# EAGLE design control_100 (EAGLE 6.1)
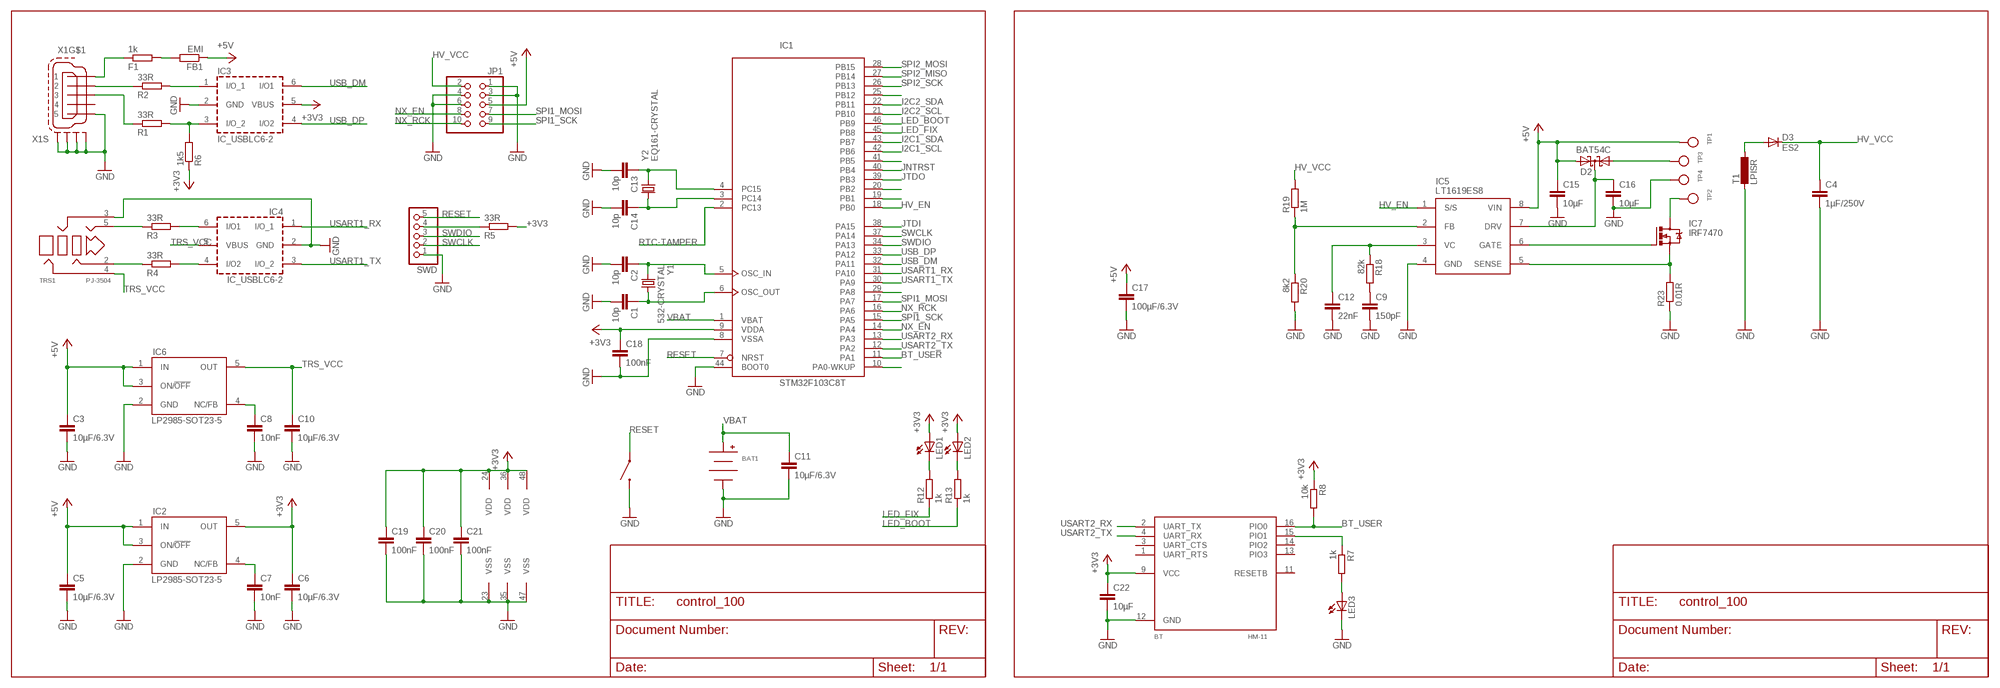
[diagram p0: schematic, sheet 1]

## Parts
BAT1  CR1220-HOLDER  [HARWIN-CR1220]
BT  HM-11  [HM-11]
C1  10p  C-EUC0603  [C0603]
C2  10p  C-EUC0603  [C0603]
C3  10µF/6.3V  C-EUC0603  [C0603]
C4  1µF/250V  C-EUC2220K  [C2220K]
C5  10µF/6.3V  C-EUC0603  [C0603]
C6  10µF/6.3V  C-EUC0603  [C0603]
C7  10nF  C-EUC0603  [C0603]
C8  10nF  C-EUC0603  [C0603]
C9  150pF  C-EUC0603  [C0603]
C10  10µF/6.3V  C-EUC0603  [C0603]
C11  10µF/6.3V  C-EUC0603  [C0603]
C12  22nF  C-EUC0603  [C0603]
C13  10p  C-EUC0603  [C0603]
C14  10p  C-EUC0603  [C0603]
C15  10µF  C-EUC0603  [C0603]
C16  10µF  C-EUC0603  [C0603]
C17  100µF/6.3V  C-EUC1210  [C1210]
C18  100nF  C-EUC0603  [C0603]
C19  100nF  C-EUC0603  [C0603]
C20  100nF  C-EUC0603  [C0603]
C21  100nF  C-EUC0603  [C0603]
C22  10µF  C-EUC0603  [C0603]
D2  BAT54C  [SOT23]
D3  ES2  [DO-214AA]
F1  1k  R-EU_R0603  [R0603]
FB1  EMI  R-EU_R0603  [R0603]
IC1  STM32F103C8T  [LQFP48]
IC2  LP2985-SOT23-5  [SOT23-5]
IC3  IC_USBLC6-2  [SOT-23-6L]
IC4  IC_USBLC6-2  [SOT-23-6L]
IC5  LT1619ES8  [SO8]
IC6  LP2985-SOT23-5  [SOT23-5]
IC7  IRF7470  [SO8]
ISP  TACT-SWITCH-40-40  [40-40]
JP1  PINHD-2X5_2.54-SMD  [2X05SMD]
LED1  LEDCHIP-LED0603  [CHIP-LED0603]
LED2  LEDCHIP-LED0603  [CHIP-LED0603]
LED3  LEDCHIP-LED0603  [CHIP-LED0603]
R1  33R  R-EU_R0603  [R0603]
R2  33R  R-EU_R0603  [R0603]
R3  33R  R-EU_R0603  [R0603]
R4  33R  R-EU_R0603  [R0603]
R5  33R  R-EU_R0603  [R0603]
R6  1k5  R-EU_R0603  [R0603]
R7  1k  R-EU_R0603  [R0603]
R8  10k  R-EU_R0603  [R0603]
R12  1k  R-EU_R0603  [R0603]
R13  1k  R-EU_R0603  [R0603]
R18  82k  R-EU_R0603  [R0603]
R19  1M  R-EU_M1206  [M1206]
R20  8k2  R-EU_R0603  [R0603]
R23  0.01R  R-EU_R1206  [R1206]
SWD  HEADER-1X5ROUND  [1X05_ROUND]
T1  LPISR  [PISR]
TP1  TESTPOINTROUND2MM  [TESTPOINT_ROUND_2MM]
TP2  TESTPOINTROUND2MM  [TESTPOINT_ROUND_2MM]
TP3  TESTPOINTROUND2MM  [TESTPOINT_ROUND_2MM]
TP4  TESTPOINTROUND2MM  [TESTPOINT_ROUND_2MM]
TRS1  PJ-3504  [YD-PJ-3504]
X1  MINI-USB-SCHIELD-32005-201  [32005-201]
Y1  532-CRYSTAL  [2PIN50X32]
Y2  EQ161-CRYSTAL  [EQ161]

## Nets
+3V3: BT.9(VCC) C6.1 C18.1 C19.1 C20.1 C21.1 C22.1 IC1.9(VDDA) IC1.24(VDD) IC1.36(VDD) IC1.48(VDD) IC2.5(OUT) IC3.5(VBUS) LED1.A LED2.A R5.2 R6.1 R8.1
+5V: C3.1 C5.1 C15.1 C17.1 D2.2(A2) FB1.1 IC2.1(IN) IC2.3(ON/!OFF) IC5.8(VIN) IC6.1(IN) IC6.3(ON/!OFF) JP1.5 TP1.P$1
ASDAWJIODJA: R5.1 SWD.4
BT_USER: BT.16(PIO0) IC1.11(PA1) R8.2
GND: BAT1.NEG BT.12(GND) C1.2 C2.2 C3.2 C4.2 C5.2 C6.2 C7.2 C8.2 C9.2 C10.2 C11.2 C12.2 C13.2 C14.2 C15.2 C16.2 C17.2 C18.2 C19.2 C20.2 C21.2 C22.2 IC1.8(VSSA) IC1.23(VSS) IC1.35(VSS) IC1.44(BOOT0) IC1.47(VSS) IC2.2(GND) IC3.2(GND) IC4.2(GND) IC5.4(GND) IC6.2(GND) ISP.1 ISP.2 JP1.1 JP1.3 JP1.4 JP1.6 LED3.C R20.2 R23.1 SWD.1 T1.P$2 TP4.P$1 TRS1.3 X1.5 X1.M1(S:S1) X1.M2(S:S2) X1.M3(S:S3) X1.M4(S:S4)
HV_EN: IC1.18(PB0) IC5.1(S/S)
HV_VCC: C4.1 D3.C JP1.2 R19.2
I2C1_SCL: IC1.42(PB6)
I2C1_SDA: IC1.43(PB7)
I2C2_SCL: IC1.21(PB10)
I2C2_SDA: IC1.22(PB11)
JNTRST: IC1.40(PB4)
JTDI: IC1.38(PA15)
JTDO: IC1.39(PB3)
LED_BOOT: IC1.46(PB9) R13.1
LED_FIX: IC1.45(PB8) R12.1
N$1: C1.1 IC1.6(OSC_OUT) Y1.P$1
N$2: C2.1 IC1.5(OSC_IN) Y1.P$2
N$3: F1.1 X1.1
N$4: C8.1 IC6.4(NC/FB)
N$5: IC3.3(I/O_2) R1.2 R6.2
N$7: IC4.6(I/O1) R3.2
N$8: D2.1(A1) TP3.P$1
N$9: IC5.6(GATE) IC7.4(G)
N$10: LED2.C R13.2
N$11: LED1.C R12.2
N$12: R4.1 TRS1.2
N$13: IC7.5(D) IC7.6(D) IC7.7(D) IC7.8(D) TP2.P$1
N$14: C12.1 IC5.3(VC) R18.1
N$15: C9.1 R18.2
N$16: D3.A T1.P$1
N$17: IC5.2(FB) R19.1 R20.1
N$18: IC5.5(SENSE) IC7.1(S) IC7.2(S) IC7.3(S) R23.2
N$19: C16.1 D2.3(CC) IC5.7(DRV)
N$20: C7.1 IC2.4(NC/FB)
N$22: F1.2 FB1.2
N$23: IC3.1(I/O_1) R2.2
N$24: R2.1 X1.2
N$25: IC4.4(I/O2) R4.2
N$26: BT.15(PIO1) R7.1
N$27: LED3.A R7.2
N$28: R3.1 TRS1.5
N$29: C13.1 IC1.4(PC15) Y2.P$1
N$30: C14.1 IC1.3(PC14) Y2.P$2
N$32: IC1.19(PB1)
N$34: IC1.20(PB2)
N$36: R1.1 X1.3
N$38: IC1.29(PA8)
N$42: IC1.10(PA0-WKUP)
N$48: IC1.41(PB5)
N$55: IC1.25(PB12)
NX_EN: IC1.14(PA4) JP1.8
NX_RCK: IC1.16(PA6) JP1.10
RESET: IC1.7(NRST) ISP.3 ISP.4 SWD.5
RTC-TAMPER: IC1.2(PC13)
SPI1_MOSI: IC1.17(PA7) JP1.7
SPI1_SCK: IC1.15(PA5) JP1.9
SPI2_MISO: IC1.27(PB14)
SPI2_MOSI: IC1.28(PB15)
SPI2_SCK: IC1.26(PB13)
SWCLK: IC1.37(PA14) SWD.2
SWDIO: IC1.34(PA13) SWD.3
TRS_VCC: C10.1 IC4.5(VBUS) IC6.5(OUT) TRS1.4
USART1_RX: IC1.31(PA10) IC4.1(I/O_1)
USART1_TX: IC1.30(PA9) IC4.3(I/O_2)
USART2_RX: BT.2(UART_TX) IC1.13(PA3)
USART2_TX: BT.4(UART_RX) IC1.12(PA2)
USB_DM: IC1.32(PA11) IC3.6(I/O1)
USB_DP: IC1.33(PA12) IC3.4(I/O2)
VBAT: BAT1.POS C11.1 IC1.1(VBAT)
Unconnected: BT.1(UART_RTS) BT.3(UART_CTS) BT.11(RESETB) BT.13(PIO3) BT.14(PIO2) X1.4

## Library data of the parts
BAT1 = battery-holder:CR1220-HOLDER
BT = bt:HM-11
C1-C22 = rcl:C-EU: CAPACITOR, European symbol
D2 = diode:BAT54C: Schottky Diodes Source: Fairchild .. BAT54.pdf
D3 = diode:ES2
F1 FB1 R1-R8 R12 R13 R18-R20 R23 = rcl:R-EU_: RESISTOR, European symbol
IC1 = micro-stm_v3:STM32F103C*T: ARM 32-bit Cortex™-M3 CPU 72 MHz maximum frequency 16 to 128 Kbytes of Flash memory 6 to 20 kbytes of SRAM 37 GPIOs 2.0 to 3.6 V application supply
IC2 IC6 = vreg:LP2985
IC3 IC4 = dp_devices:IC_USBLC6-2
IC5 = lt:LT1619
IC7 = ir:IRF7470
ISP = tactile-switch:TACT-SWITCH-40-40
JP1 = con-pinhead:PINHD-2X5: PIN HEADER
LED1-LED3 = led:LED: LED OSRAM: - CHIPLED LG R971, LG N971, LY N971, LG Q971, LY Q971, LO R971, LY R971 LH N974, LH R974 LS Q976, LO Q976, LY Q976 LO Q996 - Hyper CHIPLED LW Q18S LB Q993, LB Q99A, LB R99A - SideLED LS A670, LO A670, LY A670, LG A670, LP A670 LB A673, LV A673, LT A673, LW A673 LH A674 LY A675 LS A676, LA A676, LO A676, LY A676, LW A676 LS A679, LY A679, LG A679 - Hyper Micro SIDELED® LS Y876, LA Y876, LO Y876, LY Y876 LT Y87S - SmartLED LW L88C, LW L88S LB L89C, LB L89S, LG L890 LS L89K, LO L89K, LY L89K LS L896, LA L896, LO L896, LY L896 - TOPLED LS T670, LO T670, LY T670, LG T670, LP T670 LSG T670, LSP T670, LSY T670, LOP T670, LYG T670 LG T671, LOG T671, LSG T671 LB T673, LV T673, LT T673, LW T673 LH T674 LS T676, LA T676, LO T676, LY T676, LB T676, LH T676, LSB T676, LW T676 LB T67C, LV T67C, LT T67C, LS T67K, LO T67K, LY T67K, LW E67C LS E67B, LA E67B, LO E67B, LY E67B, LB E67C, LV E67C, LT E67C LW T67C LS T679, LY T679, LG T679 LS T770, LO T770, LY T770, LG T770, LP T770 LB T773, LV T773, LT T773, LW T773 LH T774 LS E675, LA E675, LY E675, LS T675 LS T776, LA T776, LO T776, LY T776, LB T776 LHGB T686 LT T68C, LB T68C - Hyper Mini TOPLED® LB M676 - Mini TOPLED Santana® LG M470 LS M47K, LO M47K, LY M47K Source: http://www.osram.convergy.de LUXEON: - LUMILED® LXK2-PW12-R00, LXK2-PW12-S00, LXK2-PW14-U00, LXK2-PW14-V00 LXK2-PM12-R00, LXK2-PM12-S00, LXK2-PM14-U00 LXK2-PE12-Q00, LXK2-PE12-R00, LXK2-PE12-S00, LXK2-PE14-T00, LXK2-PE14-U00 LXK2-PB12-K00, LXK2-PB12-L00, LXK2-PB12-M00, LXK2-PB14-N00, LXK2-PB14-P00, LXK2-PB14-Q00 LXK2-PR12-L00, LXK2-PR12-M00, LXK2-PR14-Q00, LXK2-PR14-R00 LXK2-PD12-Q00, LXK2-PD12-R00, LXK2-PD12-S00 LXK2-PH12-R00, LXK2-PH12-S00 LXK2-PL12-P00, LXK2-PL12-Q00, LXK2-PL12-R00 Source: www.luxeon.com KINGBRIGHT: KA-3528ASYC Source: www.kingbright.com
SWD = microbuilder:HEADER-1X5: PIN HEADER
T1 = fastron:L
TP1-TP4 = microbuilder:TESTPOINT: Test Point Various test points for characterisation and PCB testing TESTPOINT_SMT - Compact Surface Mount Test Point [Digikey: 5016KTR-ND]
TRS1 = con-trs:PJ-3504
X1 = con-cypressindustries:MINI-USB-SCHIELD-: MINI USB-B Conector Source: www.cypressindustries.com; OC_FARNELL: unknown; OC_NEWARK: unknown
Y1 = euroquartz:532-CRYSTAL
Y2 = euroquartz:EQ161-CRYSTAL: ￼Miniature SMD 3.2 x 1.5 x 0.75mm

## Board
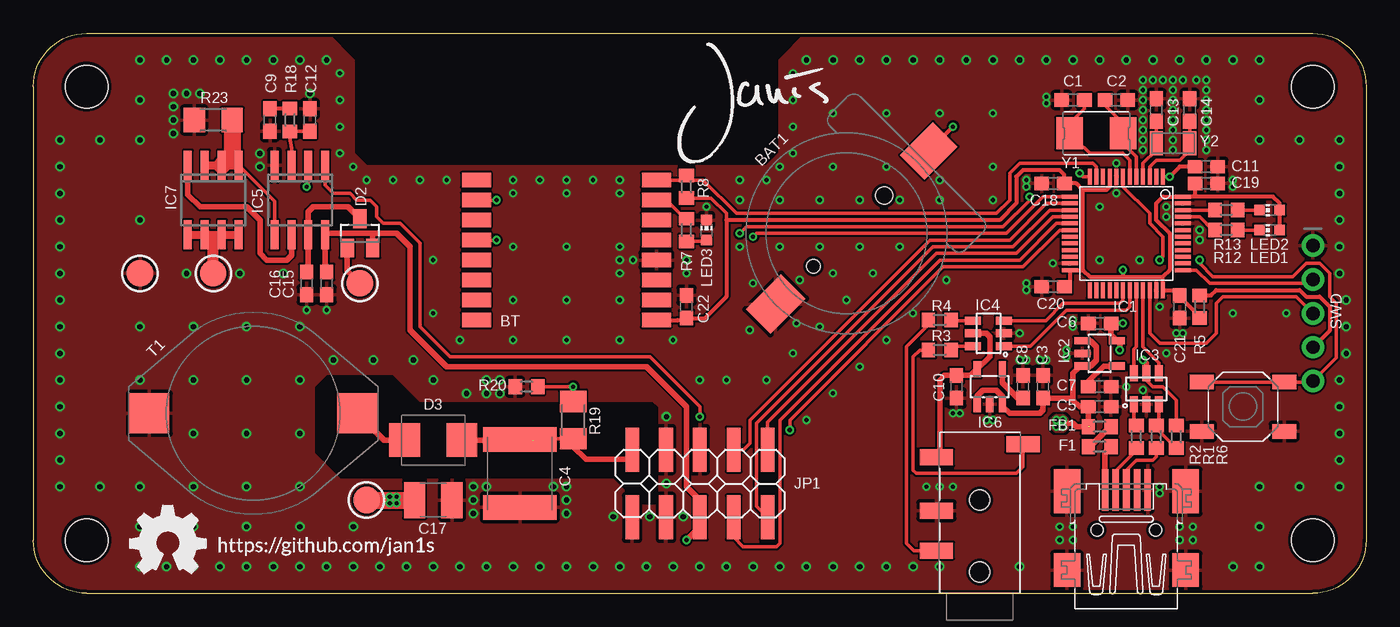
[diagram p1: board, top side]
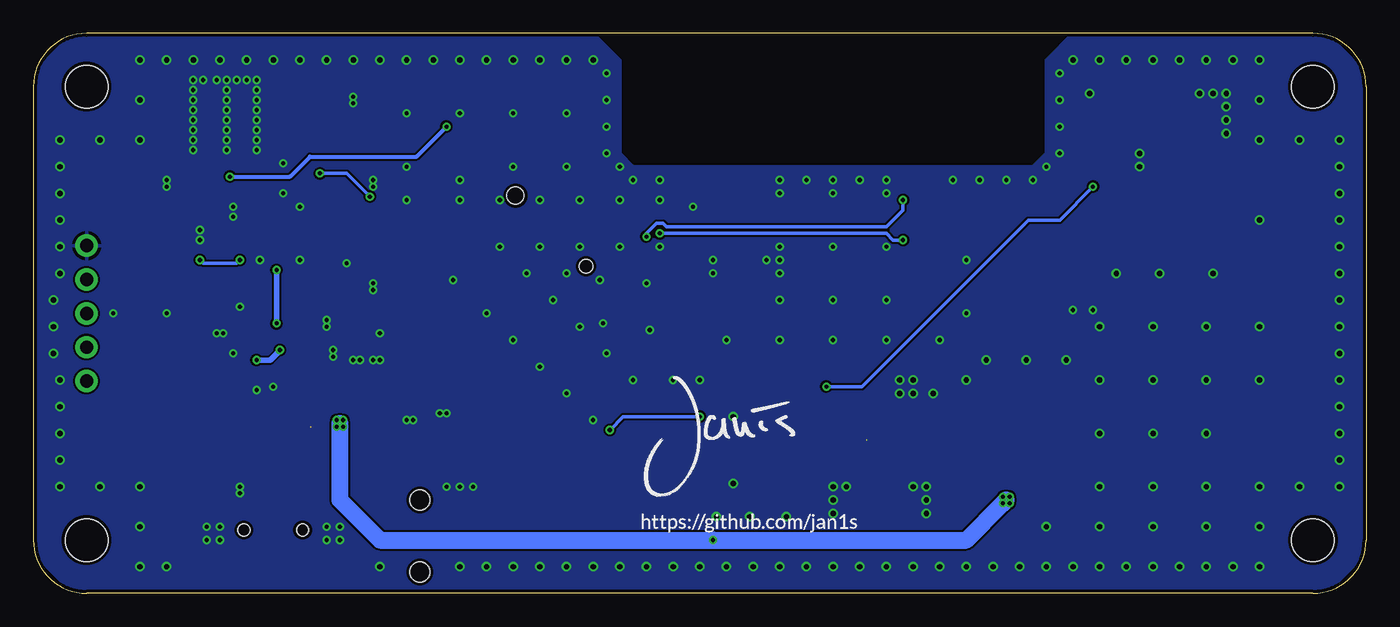
[diagram p2: board, bottom side, seen from below]

Size 100 x 42 mm. Coordinates in mm from the lower left corner, seen from the top.
Outline: 4,0 96,0 arc90 100,4 100,38 arc90 96,42 4,42 arc90 0,38 0,4 arc90 4,0
Copper layers (1*16): Top 0.035mm / dielectric 1.5mm / Bottom 0.035mm
Design rules: minimum track width 6mil, minimum drill 12mil, track to track 6mil, track to pad 6mil, pad to pad 6mil, via to via 6mil, smd to smd 0mil, copper to edge 10mil, drill to drill 10mil, minimum pad ring 10mil, minimum via ring 6mil, stop-mask expansion 2mil, vias tented up to drill 100mil, thermal gap 10mil
Holes 3.2 mm at 4,38 96,38 96,4 4,4

### Footprints (pad centres in the part's own frame; a part is rotated, then mirrored left to right if it is on the bottom)
HARWIN-CR1220 = smd 2.6 x 3.75: NEG 0,7.5 | smd 2.6 x 3.5: POS 0,-8.75 | hole 1: 0,3.5 | hole 1.3: 0,-4
HM-11 = smd 2.184 x 1.067: 1 -6.75,0; 2 -6.75,-1.5; 3 -6.75,-3; 4 -6.75,-4.5; 5 -6.75,-6; 6 -6.75,-7.5; 7 -6.75,-9; 8 -6.75,-10.5; 9 6.75,-10.5; 10 6.75,-9; 11 6.75,-7.5; 12 6.75,-6; 13 6.75,-4.5; 14 6.75,-3; 15 6.75,-1.5; 16 6.75,0
C0603 = smd 1.1 x 1: 1 -0.85,0; 2 0.85,0
C2220K = smd 1.85 x 5.5: 1 -2.55,0; 2 2.55,0
C1210 = smd 1.6 x 2.7: 1 -1.4,0; 2 1.4,0
SOT23 = smd 1 x 1.4: 1 -0.95,-1.1; 2 0.95,-1.1; 3 0,1.1
DO-214AA = smd 2.3 x 2.5: A 2.15,0; C -2.15,0
R0603 = smd 1 x 1.1: 1 -0.85,0; 2 0.85,0
LQFP48 = smd 0.3 x 1.2: 1 -2.75,-4.25; 2 -2.25,-4.25; 3 -1.75,-4.25; 4 -1.25,-4.25; 5 -0.75,-4.25; 6 -0.25,-4.25; 7 0.25,-4.25; 8 0.75,-4.25; 9 1.25,-4.25; 10 1.75,-4.25; 11 2.25,-4.25; 12 2.75,-4.25; 25 2.75,4.25; 26 2.25,4.25; 27 1.75,4.25; 28 1.25,4.25; 29 0.75,4.25; 30 0.25,4.25; 31 -0.25,4.25; 32 -0.75,4.25; 33 -1.25,4.25; 34 -1.75,4.25; 35 -2.25,4.25; 36 -2.75,4.25 | smd 1.2 x 0.3: 13 4.25,-2.75; 14 4.25,-2.25; 15 4.25,-1.75; 16 4.25,-1.25; 17 4.25,-0.75; 18 4.25,-0.25; 19 4.25,0.25; 20 4.25,0.75; 21 4.25,1.25; 22 4.25,1.75; 23 4.25,2.25; 24 4.25,2.75; 37 -4.25,2.75; 38 -4.25,2.25; 39 -4.25,1.75; 40 -4.25,1.25; 41 -4.25,0.75; 42 -4.25,0.25; 43 -4.25,-0.25; 44 -4.25,-0.75; 45 -4.25,-1.25; 46 -4.25,-1.75; 47 -4.25,-2.25; 48 -4.25,-2.75
SOT23-5 = smd 0.55 x 1.2: 1 -0.95,-1.3; 2 0,-1.3; 3 0.95,-1.3; 4 0.95,1.3; 5 -0.95,1.3
SOT-23-6L = smd 0.6 x 1.2: 1 -0.95,-2.3; 2 0,-2.3; 3 0.95,-2.3; 4 0.95,0; 5 0,0; 6 -0.95,0
SO8 = smd 0.6 x 2.2: 1 -1.905,-2.6; 2 -0.635,-2.6; 3 0.635,-2.6; 4 1.905,-2.6; 5 1.905,2.6; 6 0.635,2.6; 7 -0.635,2.6; 8 -1.905,2.6
40-40 = smd 1.8 x 1.1: 1 -3.1,1.85; 2 3.1,1.85; 3 -3.1,-1.85; 4 3.1,-1.85
2X05SMD = smd 1.016 x 3.302: 1 -1.27,-3.81; 2 -1.27,1.27; 3 1.27,-3.81; 4 1.27,1.27; 5 3.81,-3.81; 6 3.81,1.27; 7 6.35,-3.81; 8 6.35,1.27; 9 8.89,-3.81; 10 8.89,1.27
CHIP-LED0603 = smd 0.8 x 0.8: A 0,-0.75; C 0,0.75
M1206 = smd 1.6 x 2: 1 -1.4,0; 2 1.4,0
R1206 = smd 1.6 x 1.803: 1 -1.422,0; 2 1.422,0
1X05_ROUND = drill 1 pad 1.676: 1 -5.08,0; 2 -2.54,0; 3 0,0; 4 2.54,0; 5 5.08,0
PISR = smd 3 x 3: P$1 7.8,0; P$2 -7.8,0
TESTPOINT_ROUND_2MM = smd 2 x 2: P$1 0,0
YD-PJ-3504 = smd 1.2 x 2.5: 2 3.2,3.25; 3 6.2,3.25; 4 10.2,3.25; 5 11.2,-3.25 | hole 1.5: 1.6,0; 7,0
32005-201 = smd 3.1 x 0.5: 1 3,1.6; 2 3,0.8; 3 3,0; 4 3,-0.8; 5 3,-1.6 | smd 2.5 x 2: M1 -3,-4.45; M2 -3,4.45 | smd 3.3 x 2: M3 2.9,4.45; M4 2.9,-4.45 | hole 0.9: 0,2.2; 0,-2.2
2PIN50X32 = smd 2 x 2.4: P$1 -2,0; P$2 2,0
EQ161 = smd 1 x 1.8: P$1 -1.25,0; P$2 1.25,0

### Placement (x,y rotation side)
BAT1  61,27 135 top
BT  40,31 0 top
C1  78,37 180 top
C2  81.25,37 0 top
C3  75.75,15.5 90 top
C4  36.5,9 270 top
C5  80,14 0 top
C6  80,20.25 180 top
C7  80,15.5 0 top
C8  74.25,15.5 90 top
C9  17.75,35.5 270 top
C10  69.25,15.5 270 top
C11  88,32 0 top
C12  20.75,35.5 90 top
C13  84.25,36.25 90 top
C14  86.75,36.25 90 top
C15  22,23.25 270 top
C16  20.5,23.25 270 top
C17  30,7 0 top
C18  76.5,30.75 180 top
C19  88,30.75 0 top
C20  76.5,23 180 top
C21  86,21.5 270 top
C22  49,21.5 90 top
D2  24.5,27 0 top
D3  30,11.5 180 top
F1  80,11 180 top
FB1  80,12.5 0 top
IC1  82,27 180 top
IC2  80,18 270 top
IC3  83.5,16.5 0 top
IC4  70.5,19.5 90 top
IC5  20,29.5 180 top
IC6  71.75,15.5 0 top
IC7  13.5,29.5 180 top
ISP  90.75,14 180 top
JP1  46.2,9.5 0 top
LED1  92.75,27.25 90 top
LED2  92.75,28.75 90 top
LED3  50.5,27.25 0 top
LOGO1  OSHW_LOGO_FILLX0200-NT  [OSHW_FILLX200_NOTEXT]  7.25,1.5 0 top
R1  84.25,11.75 90 top
R2  82.75,11.75 90 top
R3  68,18.25 0 top
R4  68,20.5 0 top
R5  87.5,21.5 270 top
R6  85.75,11.75 270 top
R7  49,27.25 270 top
R8  49,30.5 90 top
R12  89.5,27.25 0 top
R13  89.5,28.75 0 top
R18  19.25,35.5 90 top
R19  40.5,13 270 top
R20  37,15.5 180 top
R23  13.5,35.5 0 top
SWD  96,21 270 top
T1  16.5,13.5 0 top
TP1  25,7 0 top
TP2  13.5,24 0 top
TP3  24.5,23.25 0 top
TP4  8,24 0 top
TRS1  71,0 90 top
U$1  [JANIS_10MM]  48,32 0 top
U$2  [JANIS_10MM]  54.5,7 0 bottom
U$5  [GITHUB/JAN1S]  13.75,3 0 top
U$6  [GITHUB/JAN1S]  54.5,4.75 0 bottom
X1  82,4.75 90 top
Y1  79.75,34.5 0 top
Y2  85.5,33.75 0 top

### Tracks (layer width: path | path; a pad name or v marks a point on that pad's centre or on a via)
+3V3  (via drill 0.32)
  Top 0.254: R6.1 85.75,14.5 84.75,15.5 84,15.5 83.5,16 IC3.5 | R8.1 50.85,29.65 52,28.5 52,28
  Top 0.305: C20.1 77.75,23.4 IC1.24 78.75,24.25 | IC1.9 80.75,30.5 80.5,30.25 78.75,30.25 | 78.75,30.25 78.25,30.75 C18.1 77.35,31.4 77,31.75 74.25,31.75 73.75,31.25 73.75,29.25 72.5,28 52,28 52,22.25 50.4,20.65 C22.1 48.35,20.5 BT.9 | 78.75,24.25 78.75,30.25 | LED1.A LED2.A 93.5,29.25 93,29.75 87,29.75 | 87,29.75 IC1.48 84.75,29.75 84.25,29.25 84.25,28 85.25,27 85.25,24.25 84.75,23.75 | 84.75,23.75 IC1.36 85.6,22.75 C21.1 86,22.25 87.5,20.75 R5.2 | 78.75,24.25 79.25,23.75 81.75,23.75 | 81.75,23.75 84.75,23.75 | v81.75,24.25 81.75,23.75 | C19.1 87.15,29.9 87,29.75
  Top 0.406: IC3.5 83.5,17.25 v83.25,17.5 | v81.5,18.25 81.5,18.75 IC2.5 80.85,19.4 C6.1 v81.75,20.25
  Bottom 0.406: v83.25,17.5 82.25,17.5 v81.5,18.25 | v81.75,20.25 v81.75,24.25
+5V  (via drill 0.32)  (1 unrouted)
  Top 0.406: C15.1 21.91,24.85 IC5.8 22,27 25.5,27 | D2.2 25.45,26.95 25.5,27 | C17.1 27,7 v26.75,6.75 | 25.5,27 27.25,27 28.25,26 28.25,19.75 31,17 46,17 49,14 49,8 50.01,6.99 JP1.5 50,5 v49,4 | FB1.1 C5.1 78.5,14 78,14.5 | 78,14.5 78,16.5 78.55,17.05 IC2.3 79.3,17.05 79.75,17.5 79.75,18.5 79.3,18.95 IC2.1 | IC6.1 70.8,14.8 71.25,15.25 72.25,15.25 72.7,14.8 IC6.3 72.7,14.05 73.25,13.5 75.5,13.5 75.75,13.75 C3.1 | 77.25,12.75 78,12.75 78.25,12.5 79.25,12.5 | C3.1 75.75,14.75 76,15 | C3.1 77.85,14.65 78,14.5
  Top 1.27: TP1.P$1 C17.1
  Bottom 0.254: 77,12.75 v76.75,13
  Bottom 0.406: 27,7 v26.75,6.75 v27.25,6.75 | 27,7 v27.25,7.25 | 27,7 v26.75,7.25
  Bottom 1.27: 27,7 v27.25,6.75 30,4 v49,4 74,4 77,7 77,12.75
  other vias: 77.25,13 77.25,12.5 76.75,12.5
  pour Top: 76.5,13 76.5,12.5 76.75,12.25 77.25,12.25 77.5,12.5 77.5,13 77.25,13.25 76.75,13.25
ASDAWJIODJA
  Top 0.305: R5.1 88.35,22.35 88.75,22.75 95,22.75 95.5,22.25 96.5,22.25 97.25,21.5 97.25,19.71 SWD.4
BT_USER
  Top 0.254: IC1.11 79.75,32 79.5,32.25 74,32.25 73.25,31.5 73.25,29.5 72.25,28.5 52.75,28.5 50.25,31 49.1,31 R8.2 48.9,31 BT.16
GND  (via drill 0.32, 0.4)
  other vias: 98,16 98.5,18 92,5 98,14 98,12 52,2 92,40 88,40 86,40 84,40 82,40 80,40 76,40 74,40 72,40 66,40 64,40 62,40 60,40 58,40 22,40 20,40 18,40 16,40 14,40 12,40 10,40 8,40 2,34 2,32 2,30 2,28 2,26 2,24 2,22 2,20 2,18 2,16 2,14 2,12 2,10 2,8 8,2 10,2 12,2 14,2 16,2 18,2 20,2 22,2 24,2 26,2 28,2 30,2 32,2 34,2 36,2 38,2 42,2 44,2 50,2 54,2 56,2 58,2 60,2 98,34 98,32 98,30 68,40 70,40 92,2 90,2 95,8 98,28 98,26 98,24 98.5,22 98.5,20 46,2 48,2 40,2 78,40 90,40 20.75,37.5 17,32 17,33 18.75,24 10.5,35.5 10.5,36.5 10.5,37.5 11.5,37.5 12.5,37.5 10.5,34.5 20,20 16,20 12,20 12,12 16,12 20,12 16,8 12,8 12,5 16,5 33,8 33,7 34,8 39,8 40,8 40,7 43.5,5.75 40,6 16,16 28.5,17.5 20,16 35,15 34,16 30,16 35,16 20,8 20,5 12,16 32.5,15 34,15 8,8 5,8 8,5 8,34 8,37 5,34 8,16 24,5 8,28 11.5,24 33,6 22.5,17.5 15.5,24 25.5,17.5 8,20 92,8 98,8 98,10 74,19.5 74,17.5 74.5,17.5 81.25,30 81.25,32.25 74.5,31 85,29 86.25,19.5 62,2 64,2 66,2 68,2 74,2 92,37 92,34 95,34 68,36 80,25 72,36 74.5,30.5 76.5,24.75 74.5,23.25 74.5,22.75 84.5,21.5 85.75,19.5 85,28.25 87.5,27.25 87.5,26.5 90,31 90,30.5 85.5,33.25 85.5,34 85.5,34.75 85.5,35.5 85.5,36.25 85.5,37 85.5,37.75 85.5,38.5 86.25,38.5 87.25,38.5 84.75,38.5 84,38.5 88,33.25 88,34 88,34.75 88,35.5 88,36.25 88,37 88,37.75 88,38.5 83.25,34.75 76,36.75 76,37.25 83.25,38.5 83.25,37 83.25,37.75 83.25,36.25 83.25,34 83.25,33.25 83.25,35.5 78,20.5 78,20 77.5,18.25 77.5,17.75 83.25,15.25 82,15.5 69,13.5 69.5,13.5 75.5,17.5 76,17.5 71.5,13 72,13 77,4 78,4 86,4 87,4 84.5,8 84.5,7.5 86,5 87,5 78,5 77,5 67,8 68,8 69,8 47.5,8.25 48.75,5.75 46.25,5.75 47.5,13.25 49,24 49,25 50.5,29 64,32 68,31 72,32 50,16 60,24 60,32 60,36 64,36 32,19 30,21 40,19 36,19 44,19 48,19 53.75,19.75 52,16 40,22 44,22 36,22 36,26 40,26 44,26 44,30 40,30 36,30 30,25 23,39 23,37 24,32 25,31 23,35 23,33 27,31 29,31 31,31 36,31 38,31 40,31 42,31 44,31 57,39 57,37 57,35 57,33 56,32 55,31 53,31 44,25 45,25 44,24 80,29 83,25 85,18 90,21 94,21 53,26 53,29.5 65,26 68.5,23.5 58,13 60,15 62,17 64,19 66,21 63,24 61,22 59,20 57,18 55,16 54,23.25 57.25,20.25 57.5,23.5 56,26 56,29.5 59,29.5 59,26 62,26 62,29.5 65,29.5 68,29.5 72,29.5 20.5,21.25 22,21.25
  pour Top (rank 5): 3,42 22,42 24,40 24,33 25,32 55,32 56,33 56,40 58,42 97,42 100,39 100,3 97,0 47,0 47,14 46.5,14.5 29,14.5 27,16.5 22,16.5 21,15.5 21,10.5 23,8.5 43.5,8.5 45.5,6.5 45.5,0 3,0 0,3 0,39
  pour Bottom: 3,42 22,42 24,40 24,33 25,32 55,32 56,33 56,40 58,42 97,42 100,39 100,3 97,0 21.5,0 21.5,-2 16,-2 16,0 3,0 0,3 0,39
  pour Top: 45.5,0 49.5,0 49.5,6.5 45.5,6.5
HV_EN  (via drill 0.32)
  Top 0.254: IC5.1 21.91,30.59 22.5,30 23.75,30 24.25,29.5 25.25,29.5 25.75,29 25.75,28.25 26.25,27.75 27.5,27.75 29,26.25 29,20 31.25,17.75 46.25,17.75 50,14 v50,13.25 | IC1.18 77,27.25 74.25,24.5 68.25,24.5 56.75,13 v56.75,12.25
  Bottom 0.254: v50,13.25 55.75,13.25 v56.75,12.25
HV_VCC  (1 unrouted)
  Top 0.254: R19.2 37.6,11.6 37.5,11.5
  Top 0.406: R19.2 40.45,11.55 40.45,11.05 41.45,10.05 44.93,10.05 JP1.2 | D3.C 37.45,11.5 C4.1
LED_BOOT
  Top 0.254: IC1.46 R13.1
LED_FIX
  Top 0.254: IC1.45 87.5,28.25 88.5,27.25 R12.1
N$1
  Top 0.254: IC1.6 82.25,32.5 81.75,33 79.25,33 78.25,34 78.25,34.25 Y1.P$1 78,35.5 78.85,36.35 C1.1
N$2
  Top 0.254: IC1.5 82.75,32.75 81.75,33.75 Y1.P$2 82,35 80.4,36.6 C2.1
N$3
  Top 0.406: X1.1 80.4,10.55 F1.1
N$4
  Top 0.406: C8.1 73.85,14.65 72.7,15.8 IC6.4
N$5
  Top 0.254: IC3.3 84.45,12.8 R1.2 84.25,12.4 R6.2
N$7
  Top 0.254: IC4.6 69.15,18.55 R3.2
N$8
  Top 0.406: D2.1 23.55,24.2 TP3.P$1
N$9
  Top 0.406: IC7.4 11.6,29.91 12.5,29 16,29 17,28 17,25.5 17.5,25 19,25 19.36,25.36 IC5.6
N$10
  Top 0.254: R13.2 LED2.C
N$11
  Top 0.254: R12.2 LED1.C
N$12
  Top 0.254: TRS1.2 66.05,3.2 65.5,3.75 65.5,18.5 67.15,20.15 R4.1
N$13
  Top 0.406: 13.5,26.77 13,26.77 IC7.6
  Top 0.61: IC7.5 IC7.6 | IC7.6 12.9,26.9 13,27 | IC7.6 IC7.7 IC7.8
  Top 0.813: TP2.P$1 13.5,26.77
N$14
  Top 0.254: IC5.3 19.36,33.37 19.25,34 R18.1 C12.1
N$15
  Top 0.305: R18.2 C9.1
N$16
  Top 0.406: D3.A 26.3,11.5 T1.P$1
N$17  (via drill 0.32)
  Top 0.254: R19.1 v40.5,15.5 R20.1 | IC5.2 20.64,30.64 v20.5,30.5
  Bottom 0.254: 38,15.5 v40.5,15.5 R20.1 25.35,28 23,28 v20.5,30.5
N$18
  Top 0.254: IC5.5 18.09,29.41 IC7.1
  Top 0.61: IC7.3 IC7.2 IC7.1
  Top 1.27: R23.2 14.92,32.89 IC7.2
N$19
  Top 0.406: C16.1 20.64,24.85 IC5.7 20.64,28.64 21,29 23.6,29 D2.3
N$20
  Top 0.406: C7.1 79.15,15.9 80.3,17.05 IC2.4
N$22
  Top 0.406: F1.2 79.25,11 80.75,12.5 FB1.2
N$23
  Top 0.254: IC3.1 82.55,12.8 R2.2
N$24
  Top 0.254: X1.2 81.2,9.2 82.75,10.75 R2.1
N$25
  Top 0.254: IC4.4 68.9,20.45 R4.2
N$26
  Top 0.254: BT.15 47.5,29.5 48.9,28.1 R7.1
N$27
  Top 0.254: R7.2 50.4,26.4 LED3.A
N$28
  Top 0.254: TRS1.5 74.25,9.5 73.75,9 66.25,9 66,9.25 66,17.75 66.5,18.25 R3.1
N$29
  Top 0.254: IC1.4 83.25,32.25 84.25,33.25 Y2.P$1 C13.1
N$30
  Top 0.254: IC1.3 83.75,32 84.25,32.5 86,32.5 86.75,33.25 Y2.P$2 C14.1
N$36
  Top 0.254: X1.3 82,9.25 82.75,10 84,10 84.25,10.25 R1.1
NX_EN
  Top 0.254: JP1.8 53.27,10.77 53.75,11.25 53.75,13 67.25,26.5 73.25,26.5 76,29.25 IC1.14
NX_RCK
  Top 0.254: JP1.10 55.09,12.84 67.75,25.5 73.75,25.5 76.5,28.25 IC1.16
RESET  (via drill 0.32)
  Top 0.254: IC1.7 81.75,30.5 83.75,28.5 83.75,27.75 84.75,26.75 84.75,25.25 v84.5,25 | v87.5,25 87.5,24.75 88.5,23.75 94.5,23.75 95.5,24.75 96.5,24.75 97.25,24 97.25,22.25 97.75,21.75 97.75,17.67 SWD.5 95.93,15.85 ISP.3 ISP.4
  Bottom 0.254: v84.5,25 84.75,24.75 87.25,24.75 v87.5,25
SPI1_MOSI
  Top 0.254: JP1.7 52.55,4.2 53.25,3.5 55.75,3.5 56,3.75 56,13 68,25 74,25 76.75,27.75 IC1.17
SPI1_SCK
  Top 0.254: JP1.9 54.25,6.53 54.25,12.75 67.5,26 73.5,26 76.25,28.75 IC1.15
SWCLK
  Top 0.254: IC1.37 87.25,24.25 88.25,23.25 95.75,23.25 96,23.5 SWD.2
SWDIO
  Top 0.254: IC1.34 83.75,19.5 84.5,18.75 88,18.75 88.75,19.5 88.75,21.75 89.25,22.25 94.75,22.25 SWD.3
TRS_VCC
  Top 0.406: 68,10.5 68,16 68.35,16.35 C10.1 70.35,16.35 IC6.5 71.75,17.75 71.75,19.25 71.5,19.5 IC4.5 | 68,10.5 68,10.45 TRS1.4 | 67.75,10.25 68,10.5
USART1_RX
  Top 0.254: IC4.1 74.8,18.55 77.5,21.25 82,21.25 82.25,21.5 IC1.31
USART1_TX
  Top 0.254: IC4.3 75.95,20.45 77.25,21.75 81.5,21.75 81.75,22 IC1.30
USART2_RX  (via drill 0.32)
  Top 0.254: IC1.13 75.75,29.75 73,27 54.25,27 v54,26.75 | v34.75,29.5 BT.2
  Bottom 0.254: v54,26.75 54,27 53.25,27.75 52.75,27.75 52.5,27.5 36,27.5 34.75,28.75 v34.75,29.5
USART2_TX  (via drill 0.32)
  Top 0.254: IC1.12 78.75,31.25 v78.5,31.5 | v74.75,29.75 74.75,29.5 72.75,27.5 53.5,27.5 v53,27 | BT.4 v34.75,26.5
  Bottom 0.254: v78.5,31.5 76.5,31.5 v74.75,29.75 | v53,27 36,27 35.5,26.5 v34.75,26.5
USB_DM
  Top 0.254: IC3.6 82.55,18.3 82.75,18.5 IC1.32
USB_DP
  Top 0.254: IC3.4 84.45,17.3 83.25,18.5 IC1.33
VBAT  (via drill 0.32)
  Top 0.254: IC1.1 v85.25,31.25
  Top 0.305: C11.1 86,32 v85.25,31.25 | v69,35 BAT1.POS
  Bottom 0.305: v85.25,31.25 80.75,31.25 79.25,32.75 71.25,32.75 v69,35

### Text on the board
tValues: GND | SWCLK | SWDIO | VCC | RST